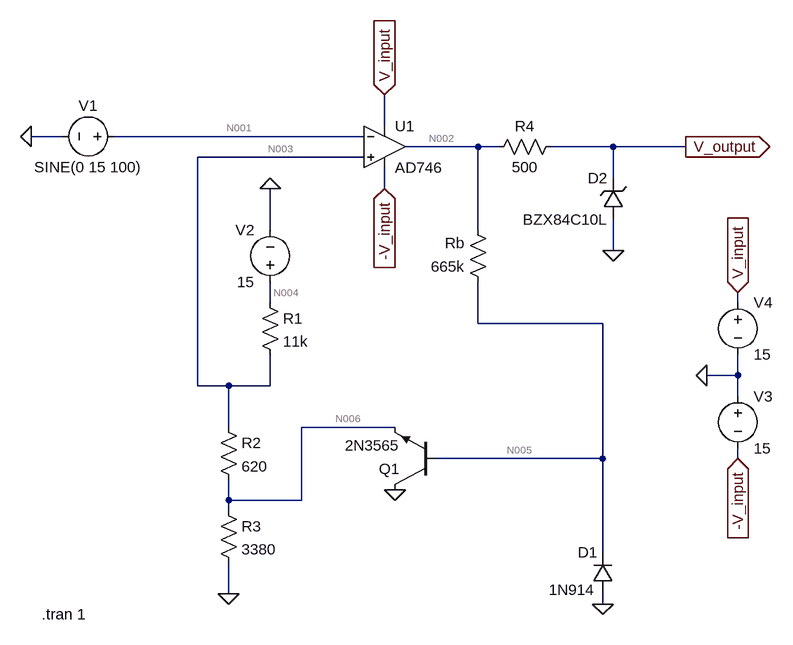
[diagram p0: schematic Триггер Шмидта.asc]
Триггер Шмидта.asc, the LTspice schematic file:
Version 4
SHEET 1 920 680
WIRE -64 -192 -64 -240
WIRE -560 -176 -608 -176
WIRE -96 -176 -480 -176
WIRE 80 -160 -32 -160
WIRE 112 -160 80 -160
WIRE 288 -160 192 -160
WIRE 400 -160 288 -160
WIRE -96 -144 -352 -144
WIRE 288 -112 288 -160
WIRE -64 -96 -64 -128
WIRE -240 -32 -240 -96
WIRE 80 -32 80 -160
WIRE 288 0 288 -48
WIRE -240 80 -240 48
WIRE 480 80 480 64
WIRE 80 112 80 48
WIRE 272 112 80 112
WIRE 480 192 480 160
WIRE 480 192 432 192
WIRE -352 208 -352 -144
WIRE -304 208 -352 208
WIRE -240 208 -240 160
WIRE -240 208 -304 208
WIRE 480 224 480 192
WIRE -304 272 -304 208
WIRE -48 272 -192 272
WIRE 272 320 272 112
WIRE 272 320 16 320
WIRE 480 320 480 304
WIRE -304 384 -304 352
WIRE -192 384 -192 272
WIRE -192 384 -304 384
WIRE -304 400 -304 384
WIRE 272 464 272 320
WIRE -304 528 -304 480
WIRE 272 544 272 528
FLAG -64 -240 V_input
IOPIN -64 -240 In
FLAG -64 -96 -V_input
IOPIN -64 -96 In
FLAG 400 -160 V_output
IOPIN 400 -160 Out
FLAG 432 192 0
FLAG 480 64 V_input
IOPIN 480 64 In
FLAG 480 320 -V_input
IOPIN 480 320 In
FLAG -304 528 0
FLAG 288 0 0
FLAG -608 -176 0
FLAG -240 -96 0
FLAG 272 544 0
FLAG -48 368 0
SYMBOL Opamps\\AD746 -64 -224 R0
SYMATTR InstName U1
SYMBOL voltage 480 208 R0
WINDOW 123 0 0 Left 0
WINDOW 39 0 0 Left 0
SYMATTR InstName V3
SYMATTR Value 15
SYMBOL voltage 480 64 R0
WINDOW 123 0 0 Left 0
WINDOW 39 0 0 Left 0
SYMATTR InstName V4
SYMATTR Value 15
SYMBOL res -256 64 R0
SYMATTR InstName R1
SYMATTR Value 11k
SYMBOL res -320 256 R0
SYMATTR InstName R2
SYMATTR Value 620
SYMBOL res -320 384 R0
SYMATTR InstName R3
SYMATTR Value 3380
SYMBOL res 208 -176 R90
WINDOW 0 0 56 VBottom 2
WINDOW 3 32 56 VTop 2
SYMATTR InstName R4
SYMATTR Value 500
SYMBOL res 96 64 R180
WINDOW 0 36 76 Left 2
WINDOW 3 36 40 Left 2
SYMATTR InstName Rb
SYMATTR Value 665k
SYMBOL diode 288 528 R180
WINDOW 0 24 64 Left 2
WINDOW 3 28 6 Left 2
SYMATTR InstName D1
SYMATTR Value 1N914
SYMBOL voltage -464 -176 R90
WINDOW 0 -32 56 VBottom 2
WINDOW 3 32 56 VTop 2
WINDOW 123 0 0 Left 0
WINDOW 39 0 0 Left 0
SYMATTR InstName V1
SYMATTR Value SINE(0 15 100)
SYMBOL voltage -240 64 R180
WINDOW 0 24 96 Left 2
WINDOW 3 24 16 Left 2
WINDOW 123 0 0 Left 0
WINDOW 39 0 0 Left 0
SYMATTR InstName V2
SYMATTR Value 15
SYMBOL zener 304 -48 R180
WINDOW 0 24 64 Left 2
WINDOW 3 24 0 Left 2
SYMATTR InstName D2
SYMATTR Value BZX84C10L
SYMATTR Description Diode
SYMATTR Type diode
SYMBOL npn 16 368 R180
SYMATTR InstName Q1
SYMATTR Value 2N3565
TEXT -592 560 Left 2 !.tran 1

The netlist it stands for:
* Триггер Шмидта.asc
XU1 N003 N001 V_input -V_input N002 AD746  ; pins In+ In- V+ V- OUT
V3 0 -V_input 15
V4 V_input 0 15
R1 N004 N003 11k
R2 N003 N006 620
R3 N006 0 3380
R4 V_output N002 500
Rb N005 N002 665k
D1 0 N005 1N914
V1 N001 0 SINE(0 15 100)
V2 N004 0 15
D2 0 V_output BZX84C10L
Q1 0 N005 N006 0 2N3565
.model D D
.lib standard.dio
.model NPN NPN
.model PNP PNP
.lib standard.bjt
.tran 1
.backanno
.end

* Results of the author's LTspice run, read from the files saved beside the schematic
* Operating Point, zero values left out:
*   V(n003) = 3.928 V
*   V(v_input) = 15 V
*   V(n002) = 13.93 V
*   V(-v_input) = -15 V
*   V(n004) = 15 V
*   V(n006) = 3.304 V
*   V(v_output) = 10.26 V
*   V(n005) = 574.6 mV
*   Ic(Q1) = -49.19 µA
*   Ib(Q1) = 20.08 µA
*   Ie(Q1) = 29.11 µA
*   I(D2) = -7.335 mA
*   I(D1) = -2.521 nA
*   I(Rb) = -20.08 µA
*   I(R4) = -7.335 mA
*   I(R3) = 977.5 µA
*   I(R2) = 1.007 mA
*   I(R1) = 1.007 mA
*   I(V2) = -1.007 mA
*   I(V1) = -110 pA
*   I(V4) = -11.85 mA
*   I(V3) = -4.673 mA
*   Ix(u1:1) = 235.7 pA
*   Ix(u1:2) = 110 pA
*   Ix(u1:3) = 11.85 mA
*   Ix(u1:4) = -4.673 mA
*   Ix(u1:5) = -7.355 mA
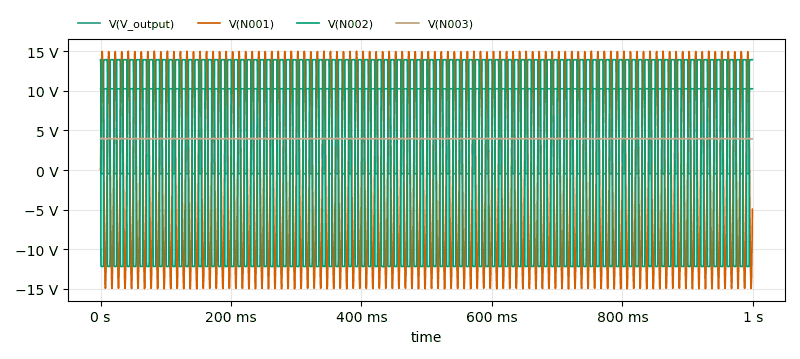
[diagram p1: Transient Analysis of Триггер Шмидта.asc, plotted from the saved traces]
* Transient Analysis, 1 run:
*   V(V_output): min -464 mV, max 10.26 V, average 5.811 V, rms 7.853 V, last 10.26 V
*   V(N001): min -15 V, max 15 V, average 5.809 mV, rms 10.61 V, last 0 V
*   V(N002): min -12.23 V, max 13.93 V, average 3.1 V, rms 13.18 V, last 13.93 V
*   V(N003): min 3.928 V, max 4.005 V, average 3.958 V, rms 3.958 V, last 3.928 V